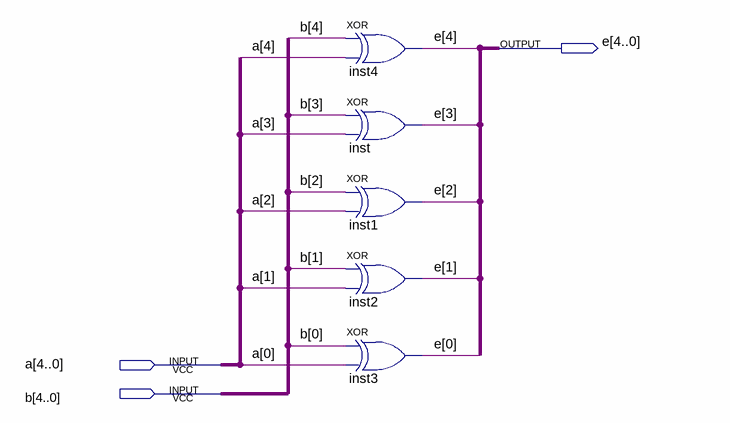
[diagram p0: schematic sheet]
// Quartus schematic xor_5bits.bdf as structural Verilog: 5 symbols, 3 pins
module xor_5bits (
  input  [4:0] a,
  input  [4:0] b,
  output [4:0] e
);

  xor inst4 (e[4], b[4], a[4]);
  xor inst (e[3], b[3], a[3]);
  xor inst1 (e[2], b[2], a[2]);
  xor inst2 (e[1], b[1], a[1]);
  xor inst3 (e[0], b[0], a[0]);
endmodule
